# EAGLE design Puzzle - Button v1 (EAGLE 6.2)
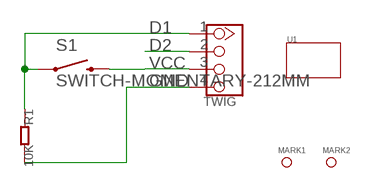
[diagram p0: schematic, sheet 1]

## Parts
J1  TWIG  TWIG-2.0-LEADED-2.0  [4P-LEADED-2.0]
MARK1  PAD-MARK  [ROUND-MARK-0.635]
MARK2  PAD-MARK  [ROUND-MARK-0.635]
R1  10K  R-0603  [0603]
S1  SWITCH-MOMENTARY-212MM  [TACTILE-PTH-12MM]
U1  TWIG-1U  [1U-DIM-W/-DRILL]

## Nets
D1: J1.1 R1.1 S1.1
D2: J1.2
GND: J1.4 R1.2
VCC: J1.3 S1.3

## Library data of the parts
J1 = Connector:TWIG-2.0-LEADED
MARK1 MARK2 = Discrete:PAD-MARK
R1 = Discrete:R*
S1 = SparkFun:SWITCH-MOMENTARY-2
U1 = Module:TWIG

## Board
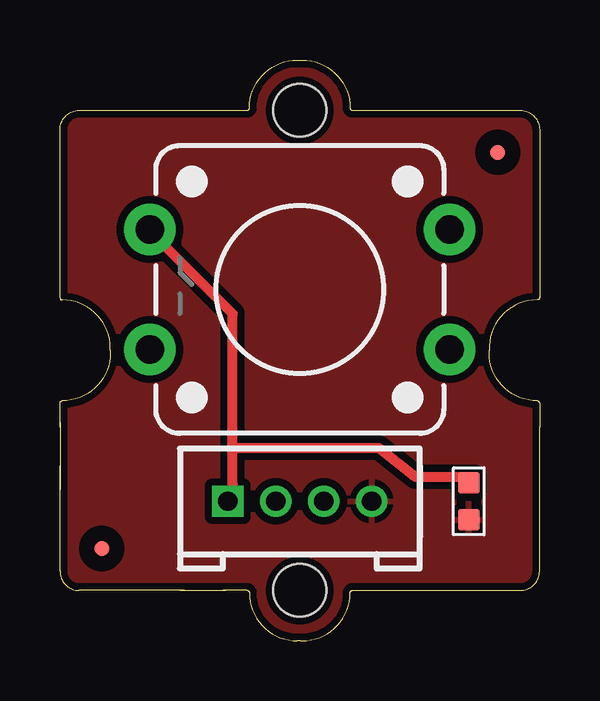
[diagram p1: board, top side]
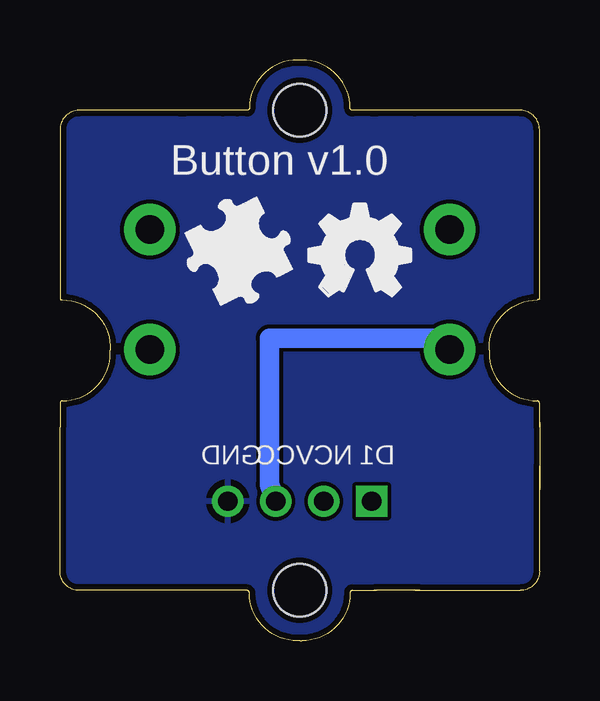
[diagram p2: board, bottom side, seen from below]

Size 20 x 24.2 mm. Coordinates in mm from the lower left corner, seen from the top.
Copper layers (1*16): Top 0.035mm / dielectric 1.5mm / Bottom 0.035mm
Design rules: minimum track width 6mil, minimum drill 12mil, track to track 6mil, track to pad 6mil, pad to pad 6mil, via to via 6mil, smd to smd 6mil, copper to edge 10mil, drill to drill 10mil, minimum pad ring 10mil, minimum via ring 8mil, stop-mask expansion 2mil, vias tented up to drill 100mil, thermal gap 10mil

### Footprints (pad centres in the part's own frame; a part is rotated, then mirrored left to right if it is on the bottom)
4P-LEADED-2.0 = drill 0.8 pad 1.27 square: 1 -3,0 | drill 0.8 pad 1.27: 2 -1,0; 3 1,0; 4 3,0
ROUND-MARK-0.635 = smd 0.635 x 0.635: P$1 0,0
0603 = smd 0.889 x 0.889: 1 -0.762,0; 2 0.762,0
TACTILE-PTH-12MM = drill 1.2 pad 2.159: 1 6.25,-2.5; 2 -6.25,-2.5; 3 6.25,2.5; 4 -6.25,2.5
1U-DIM-W/-DRILL = hole 2.2: 0,-10; 0,10

### Placement (x,y rotation side)
J1  10,5.81 0 top
LOGO2  LOGO-OSHW-FILLX0150-NT  [OSHW_FILLX150_NOTEXT]  9.62,14.39 0 bottom
MARK1  1.74,3.84 0 top
MARK2  18.25,20.35 0 top
R1  17.05,5.81 270 top
S1  10,14.64 180 top
U1  10,12.1 0 top
U$1  [BRICK-LOGO-MIL-0.5]  15.08,13.69 0 bottom

### Tracks (layer width: path | path; a pad name or v marks a point on that pad's centre or on a via)
D1
  Top 0.152: 17.05,6.83 R1.1
  Top 0.406: 17.05,6.83 14.83,6.83 13.3,8.04 7.21,8.04 | 7.21,8.04 7.21,6.51 J1.1 | 7.21,8.04 7.21,13.62 4.16,16.67 S1.1
GND
  pour Top (isolate 0.305): -0.16,-0.35 20.41,-0.35 20.41,25.05 -0.16,25.05
  pour Bottom: -0.16,-0.6 20.67,-0.6 20.67,25.31 -0.16,25.31
VCC
  Bottom 0.813: J1.3 11.27,6.51 11.27,12.61 4.16,12.61 S1.3

### Text on the board
bPlace: Button v1.0 | D1 | NC | VCC | GND